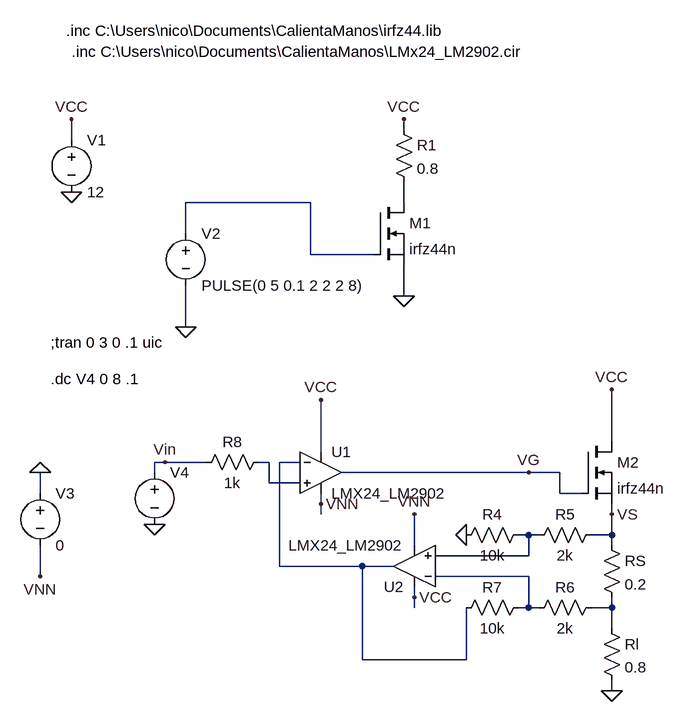
[diagram p0: schematic CircuitoControl.asc]
CircuitoControl.asc, the LTspice schematic file:
Version 4
SHEET 1 1012 964
WIRE 576 80 576 64
WIRE 64 96 64 64
WIRE 432 192 240 192
WIRE 576 192 576 160
WIRE 240 240 240 192
WIRE 432 272 432 192
WIRE 528 272 432 272
WIRE 576 336 576 288
WIRE 240 384 240 320
WIRE 896 560 896 480
WIRE 448 576 448 496
WIRE 208 592 192 592
WIRE 272 592 208 592
WIRE 368 592 352 592
WIRE 416 592 384 592
WIRE 192 608 192 592
WIRE 768 608 480 608
WIRE 816 608 768 608
WIRE 368 624 368 592
WIRE 416 624 368 624
WIRE 16 640 16 608
WIRE 816 640 816 608
WIRE 848 640 816 640
WIRE 448 656 448 640
WIRE 448 672 448 656
WIRE 896 672 896 656
WIRE 768 704 752 704
WIRE 784 704 768 704
WIRE 896 704 896 672
WIRE 896 704 864 704
WIRE 592 720 592 672
WIRE 896 720 896 704
WIRE 768 736 768 704
WIRE 768 736 624 736
WIRE 384 752 384 592
WIRE 512 752 384 752
WIRE 560 752 512 752
WIRE 16 768 16 720
WIRE 768 768 624 768
WIRE 592 800 592 784
WIRE 592 816 592 800
WIRE 768 816 768 768
WIRE 768 816 752 816
WIRE 784 816 768 816
WIRE 896 816 896 800
WIRE 896 816 864 816
WIRE 896 848 896 816
WIRE 512 896 512 752
WIRE 672 896 672 816
WIRE 672 896 512 896
WIRE 896 944 896 928
FLAG 64 176 0
FLAG 240 384 0
FLAG 576 336 0
FLAG 576 64 VCC
FLAG 64 64 VCC
FLAG 896 944 0
FLAG 672 704 0
FLAG 592 800 VCC
FLAG 592 672 VNN
FLAG 16 608 0
FLAG 16 768 VNN
FLAG 192 688 0
FLAG 896 480 VCC
FLAG 448 496 VCC
FLAG 448 656 VNN
FLAG 768 608 VG
FLAG 896 672 VS
FLAG 208 592 Vin
SYMBOL voltage 64 80 R0
WINDOW 123 0 0 Left 2
WINDOW 39 0 0 Left 2
SYMATTR InstName V1
SYMATTR Value 12
SYMBOL voltage 240 224 R0
WINDOW 123 0 0 Left 2
WINDOW 39 0 0 Left 2
SYMATTR InstName V2
SYMATTR Value PULSE(0 5 0.1 2 2 2 8)
SYMBOL nmos 528 192 R0
SYMATTR InstName M1
SYMATTR Value irfz44n
SYMBOL res 560 64 R0
SYMATTR InstName R1
SYMATTR Value 0.8
SYMBOL Opamps\\opamp2 448 544 R0
SYMATTR InstName U1
SYMATTR Value LMX24_LM2902
SYMBOL Opamps\\opamp2 592 816 R180
SYMATTR InstName U2
SYMATTR Value LMX24_LM2902
SYMBOL nmos 848 560 R0
SYMATTR InstName M2
SYMATTR Value irfz44n
SYMBOL res 880 704 R0
SYMATTR InstName RS
SYMATTR Value 0.2
SYMBOL res 880 832 R0
SYMATTR InstName Rl
SYMATTR Value 0.8
SYMBOL res 656 720 R270
WINDOW 0 32 56 VTop 2
WINDOW 3 0 56 VBottom 2
SYMATTR InstName R4
SYMATTR Value 10k
SYMBOL res 768 720 R270
WINDOW 0 32 56 VTop 2
WINDOW 3 0 56 VBottom 2
SYMATTR InstName R5
SYMATTR Value 2k
SYMBOL res 768 832 R270
WINDOW 0 32 56 VTop 2
WINDOW 3 0 56 VBottom 2
SYMATTR InstName R6
SYMATTR Value 2k
SYMBOL res 656 832 R270
WINDOW 0 32 56 VTop 2
WINDOW 3 0 56 VBottom 2
SYMATTR InstName R7
SYMATTR Value 10k
SYMBOL voltage 16 624 R0
WINDOW 123 0 0 Left 2
WINDOW 39 0 0 Left 2
SYMATTR InstName V3
SYMATTR Value 0
SYMBOL voltage 192 592 R0
WINDOW 123 0 0 Left 2
WINDOW 39 0 0 Left 2
SYMATTR InstName V4
SYMATTR Value ""
SYMBOL res 256 608 R270
WINDOW 0 32 56 VTop 2
WINDOW 3 0 56 VBottom 2
SYMATTR InstName R8
SYMATTR Value 1k
TEXT 56 -72 Left 2 !.inc C:\\Users\\nico\\Documents\\CalientaManos\\irfz44.lib
TEXT 32 408 Left 2 !;tran 0 3 0 .1 uic
TEXT 64 -40 Left 2 !.inc C:\\Users\\nico\\Documents\\CalientaManos\\LMx24_LM2902.cir
TEXT 32 464 Left 2 !.dc V4 0 8 .1

The netlist it stands for:
* CircuitoControl.asc
V1 VCC 0 12
V2 N001 0 PULSE(0 5 0.1 2 2 2 8)
M1 N002 N001 0 0 irfz44n
R1 VCC N002 0.8
XU1 N003 N004 VCC VNN VG LMX24_LM2902  ; pins In+ In- V+ V- OUT
XU2 N005 N006 VCC VNN N004 LMX24_LM2902  ; pins In+ In- V+ V- OUT
M2 VCC VG VS VS irfz44n
RS VS N007 0.2
Rl N007 0 0.8
R4 0 N005 10k
R5 N005 VS 2k
R6 N006 N007 2k
R7 N004 N006 10k
V3 0 VNN 0
V4 Vin 0
R8 Vin N003 1k
.model NMOS NMOS
.model PMOS PMOS
.lib standard.mos
.inc C:\Users\nico\Documents\CalientaManos\irfz44.lib
;tran 0 3 0 .1 uic
.inc C:\Users\nico\Documents\CalientaManos\LMx24_LM2902.cir
.dc V4 0 8 .1
.backanno
.end

* Results of the author's LTspice run, read from the files saved beside the schematic
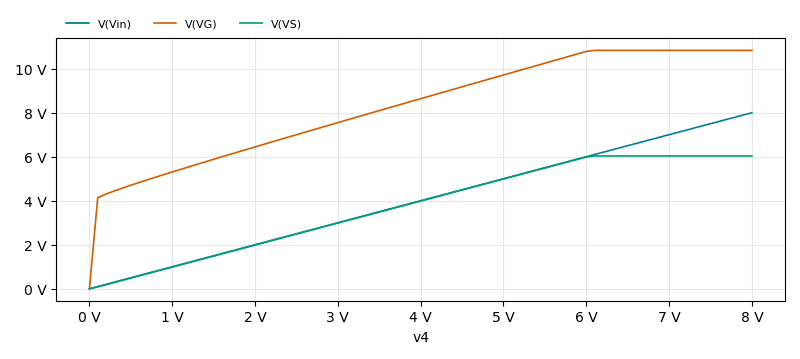
[diagram p1: DC transfer characteristic of CircuitoControl.asc, plotted from the saved traces]
* DC transfer characteristic, 1 run:
*   V(Vin): 0 V at v4=0 V, 8 V at v4=8 V, min 0 V, max 8 V
*   V(VG): 23.8 mV at v4=0 V, 10.83 V at v4=8 V, min 23.8 mV, max 10.83 V
*   V(VS): 1.615 µV at v4=0 V, 6.034 V at v4=8 V, min 1.615 µV, max 6.034 V